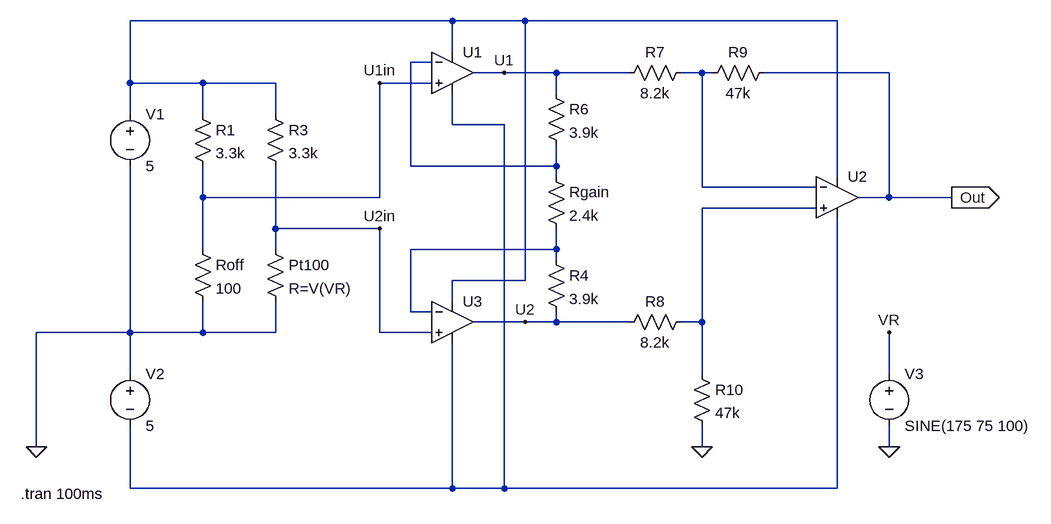
[diagram p0: schematic PT100amplifier.asc]
PT100amplifier.asc, the LTspice schematic file:
Version 4
SHEET 1 1388 836
WIRE 400 -96 -96 -96
WIRE 512 -96 400 -96
WIRE 992 -96 512 -96
WIRE 400 -48 400 -96
WIRE 368 -32 336 -32
WIRE 480 -16 432 -16
WIRE 560 -16 480 -16
WIRE 672 -16 560 -16
WIRE 784 -16 752 -16
WIRE 800 -16 784 -16
WIRE 1072 -16 880 -16
WIRE -96 0 -96 -96
WIRE 16 0 -96 0
WIRE 128 0 16 0
WIRE 368 0 288 0
WIRE 560 16 560 -16
WIRE -96 48 -96 0
WIRE 16 48 16 0
WIRE 128 48 128 0
WIRE 400 64 400 16
WIRE 480 64 400 64
WIRE 336 128 336 -32
WIRE 560 128 560 96
WIRE 560 128 336 128
WIRE 560 144 560 128
WIRE 992 144 992 -96
WIRE 784 160 784 -16
WIRE 960 160 784 160
WIRE 16 176 16 128
WIRE 288 176 288 0
WIRE 288 176 16 176
WIRE 1072 176 1072 -16
WIRE 1072 176 1024 176
WIRE 1168 176 1072 176
WIRE 960 192 784 192
WIRE 128 224 128 128
WIRE 288 224 128 224
WIRE 16 256 16 176
WIRE 128 256 128 224
WIRE 560 256 560 224
WIRE 560 256 336 256
WIRE 560 272 560 256
WIRE 512 304 512 -96
WIRE 512 304 400 304
WIRE 400 336 400 304
WIRE 336 352 336 256
WIRE 368 352 336 352
WIRE 512 368 432 368
WIRE 560 368 560 352
WIRE 560 368 512 368
WIRE 672 368 560 368
WIRE 784 368 784 192
WIRE 784 368 752 368
WIRE -96 384 -96 128
WIRE -96 384 -240 384
WIRE 16 384 16 336
WIRE 16 384 -96 384
WIRE 128 384 128 336
WIRE 128 384 16 384
WIRE 288 384 288 224
WIRE 368 384 288 384
WIRE -96 448 -96 384
WIRE 784 448 784 368
WIRE 1072 448 1072 384
WIRE -240 560 -240 384
WIRE 784 560 784 528
WIRE 1072 560 1072 528
WIRE -96 624 -96 528
WIRE 400 624 400 400
WIRE 400 624 -96 624
WIRE 480 624 480 64
WIRE 480 624 400 624
WIRE 992 624 992 208
WIRE 992 624 480 624
FLAG -240 560 0
FLAG 784 560 0
FLAG 1168 176 Out
IOPIN 1168 176 Out
FLAG 480 -16 U1
FLAG 512 368 U2
FLAG 288 0 U1in
FLAG 288 224 U2in
FLAG 1072 560 0
FLAG 1072 384 VR
SYMBOL voltage -96 32 R0
WINDOW 123 0 0 Left 0
WINDOW 39 0 0 Left 0
SYMATTR InstName V1
SYMATTR Value 5
SYMBOL voltage -96 432 R0
WINDOW 123 0 0 Left 0
WINDOW 39 0 0 Left 0
SYMATTR InstName V2
SYMATTR Value 5
SYMBOL res 0 32 R0
SYMATTR InstName R1
SYMATTR Value 3.3k
SYMATTR SpiceLine tol=5 pwr=.25
SYMBOL res 0 240 R0
SYMATTR InstName Roff
SYMATTR Value 100
SYMATTR SpiceLine tol=5 pwr=.25
SYMBOL res 112 32 R0
SYMATTR InstName R3
SYMATTR Value 3.3k
SYMATTR SpiceLine tol=5 pwr=.25
SYMBOL res 112 240 R0
SYMATTR InstName Pt100
SYMATTR Value R=V(VR)
SYMBOL OpAmps\\UniversalOpamp 400 -16 R0
SYMATTR InstName U1
SYMBOL OpAmps\\UniversalOpamp 992 176 R0
SYMATTR InstName U2
SYMBOL OpAmps\\UniversalOpamp 400 368 R0
SYMATTR InstName U3
SYMBOL res 544 128 R0
SYMATTR InstName Rgain
SYMATTR Value 2.4k
SYMATTR SpiceLine tol=5 pwr=.25
SYMBOL res 544 0 R0
SYMATTR InstName R6
SYMATTR Value 3.9k
SYMATTR SpiceLine tol=5 pwr=.25
SYMBOL res 544 256 R0
SYMATTR InstName R4
SYMATTR Value 3.9k
SYMATTR SpiceLine tol=5 pwr=.25
SYMBOL res 768 -32 R90
WINDOW 0 0 56 VBottom 2
WINDOW 3 32 56 VTop 2
SYMATTR InstName R7
SYMATTR Value 8.2k
SYMATTR SpiceLine tol=5 pwr=.25
SYMBOL res 768 352 R90
WINDOW 0 0 56 VBottom 2
WINDOW 3 32 56 VTop 2
SYMATTR InstName R8
SYMATTR Value 8.2k
SYMATTR SpiceLine tol=5 pwr=.25
SYMBOL res 896 -32 R90
WINDOW 0 0 56 VBottom 2
WINDOW 3 32 56 VTop 2
SYMATTR InstName R9
SYMATTR Value 47k
SYMATTR SpiceLine tol=5 pwr=.25
SYMBOL res 768 432 R0
SYMATTR InstName R10
SYMATTR Value 47k
SYMATTR SpiceLine tol=5 pwr=.25
SYMBOL voltage 1072 432 R0
WINDOW 123 0 0 Left 0
WINDOW 39 0 0 Left 0
SYMATTR InstName V3
SYMATTR Value SINE(175 75 100)
TEXT -264 632 Left 2 !.tran 100ms

The netlist it stands for:
* PT100amplifier.asc
V1 N001 0 5
V2 0 N004 5
R1 N001 U1in 3.3k tol=5 pwr=.25
Roff U1in 0 100 tol=5 pwr=.25
R3 N001 U2in 3.3k tol=5 pwr=.25
R§Pt100 U2in 0 R=V(VR)
XU1 U1in N002 N001 N004 U1 level1 Avol=1Meg GBW=10Meg Vos=0 En=0 Enk=0 In=0 Ink=0 Rin=500Meg  ; pins In+ In- V+ V- OUT
XU2 N005 N003 N001 N004 Out level1 Avol=1Meg GBW=10Meg Vos=0 En=0 Enk=0 In=0 Ink=0 Rin=500Meg  ; pins In+ In- V+ V- OUT
XU3 U2in N006 N001 N004 U2 level1 Avol=1Meg GBW=10Meg Vos=0 En=0 Enk=0 In=0 Ink=0 Rin=500Meg  ; pins In+ In- V+ V- OUT
Rgain N002 N006 2.4k tol=5 pwr=.25
R6 U1 N002 3.9k tol=5 pwr=.25
R4 N006 U2 3.9k tol=5 pwr=.25
R7 N003 U1 8.2k tol=5 pwr=.25
R8 N005 U2 8.2k tol=5 pwr=.25
R9 Out N003 47k tol=5 pwr=.25
R10 N005 0 47k tol=5 pwr=.25
V3 VR 0 SINE(175 75 100)
.tran 100ms
.lib UniversalOpAmp1.lib
.backanno
.end